# Altium schematic sheet MCU.SchDoc
size A; SheetNumber: 1; SheetTotal: 4
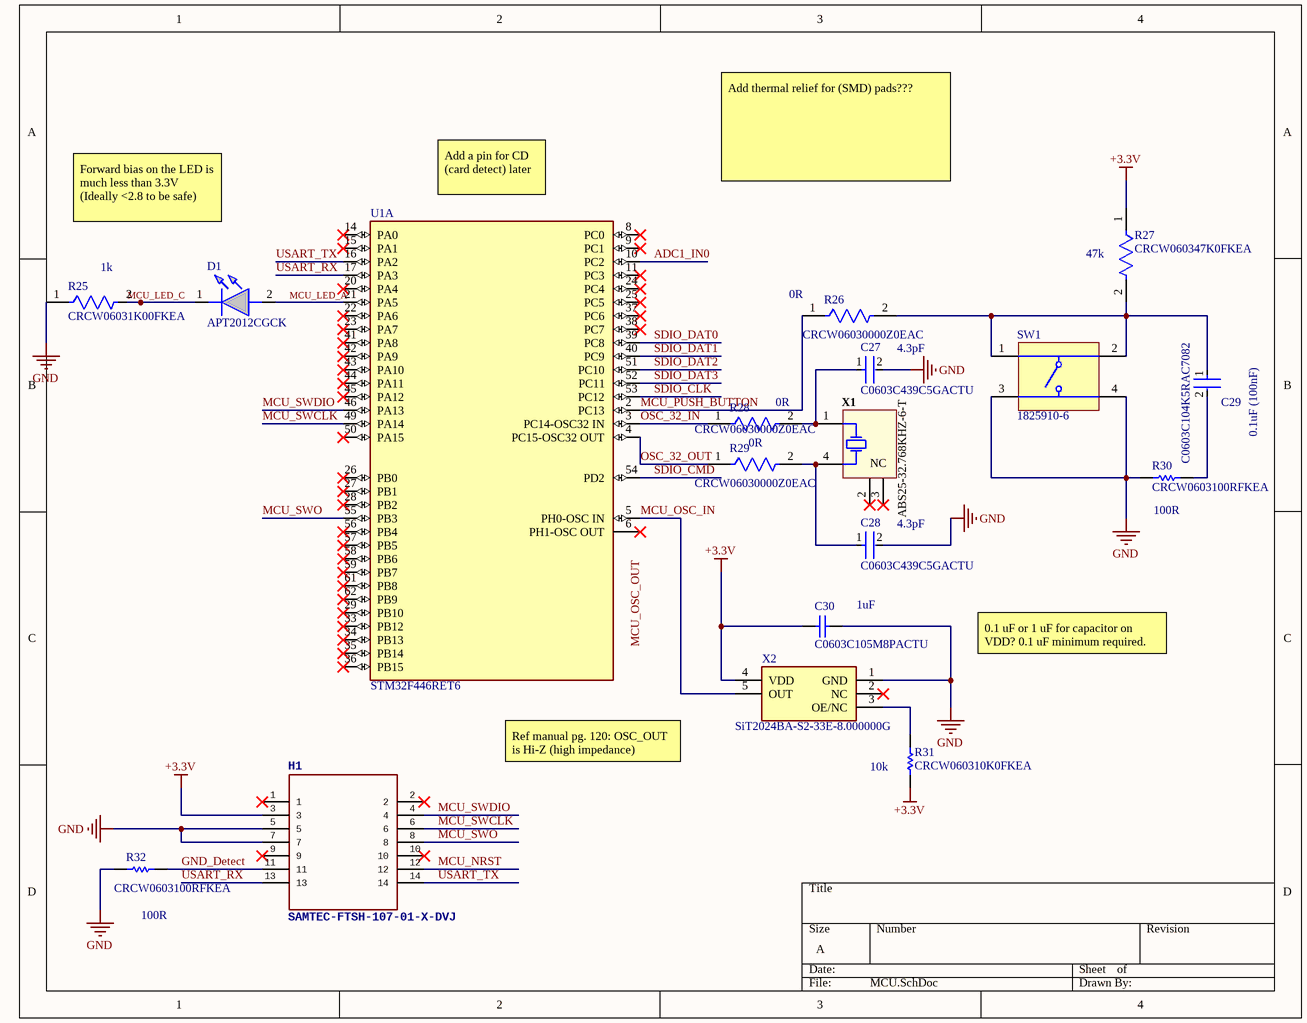
[diagram p0: MCU.SchDoc]

## Parts
C27  C0603C439C5GACTU  [FP-C0603C-CF-MFG]
C28  C0603C439C5GACTU  [FP-C0603C-CF-MFG]
C29  C0603C104K5RAC7082  [FP-C0603C-CF-MFG]
C30  C0603C105M8PACTU  [CAPC1608X90X35LL15T15]
D1  APT2012CGCK  [LEDC2012X50N]
H1  SAMTEC-FTSH-107-01-X-DVJ  [SAMTEC_FTSH-107-01-F-DV-K-P-TR]
R25  CRCW06031K00FKEA  [FP-CRCW0603-e3-MFG]
R26  CRCW06030000Z0EAC  [FP-CRCW0603-C-IPC_B]
R27  CRCW060347K0FKEA  [FP-CRCW0603-e3-IPC_B]
R28  CRCW06030000Z0EAC  [FP-CRCW0603-C-IPC_B]
R29  CRCW06030000Z0EAC  [FP-CRCW0603-C-IPC_B]
R30  CRCW0603100RFKEA  [RESC1609X50X30ML8T20]
R31  CRCW060310K0FKEA  [RESC1609X50X30NL8T20]
R32  CRCW0603100RFKEA  [RESC1609X50X30ML8T20]
SW1  1825910-6  [TECO-1825910-6_V]
U1  STM32F446RET6  [FP-LQFP64-5W-MFG]  (part A of 2)
X1  ABS25-32.768KHZ-6-T  [ABRA-ABS25-4_V]
X2  SiT2024BA-S2-33E-8.000000G  [SOT95P280X145-5N]

## Nets
+3.3V: C30.1 H1.3 R27.1 R31.2 X2.4(VDD)
GND: C27.2 C28.2 C30.2 H1.5 H1.7 R25.1 R30.2 R32.2 SW1.3 SW1.4 X2.1(GND)
ADC1_IN0: U1.10(PC2)
GND_Detect: H1.11 R32.1
MCU_LED_A: D1.2(A) U1.21(PA5)
MCU_LED_C: D1.1(K) R25.2
MCU_NRST: H1.12
MCU_OSC_IN: U1.5(PH0-OSC_IN) X2.5(OUT)
MCU_PUSH_BUTTON: R26.1 U1.2(PC13)
MCU_SWCLK: H1.6 U1.49(PA14)
MCU_SWDIO: H1.4 U1.46(PA13)
MCU_SWO: H1.8 U1.55(PB3)
OSC_32_IN: R28.1 U1.3(PC14-OSC32_IN)
OSC_32_OUT: R29.1 U1.4(PC15-OSC32_OUT)
SDIO_CLK: U1.53(PC12)
SDIO_CMD: U1.54(PD2)
SDIO_DAT0: U1.39(PC8)
SDIO_DAT1: U1.40(PC9)
SDIO_DAT2: U1.51(PC10)
SDIO_DAT3: U1.52(PC11)
USART_RX: H1.13 U1.17(PA3)
USART_TX: H1.14 U1.16(PA2)
NetC27_1: C27.1 R28.2 X1.1(X1)
NetC28_1: C28.1 R29.2 X1.4(X2)
NetC29_1: C29.1 R26.2 R27.2 SW1.1 SW1.2
NetC29_2: C29.2 R30.1
NetR31_1: R31.1 X2.3(OE/NC)

Not connected (* = marked no-connect by the designer): H1 1* 2* 9* 10*; U1 6(PH1-OSC_OUT)* 8(PC0)* 9(PC1)* 11(PC3)* 14(PA0)* 15(PA1)* 20(PA4)* 22(PA6)* 23(PA7)* 24(PC4)* 25(PC5)* 26(PB0)* 27(PB1)* 28(PB2)* 29(PB10)* 33(PB12)* 34(PB13)* 35(PB14)* 36(PB15)* 37(PC6)* 38(PC7)* 41(PA8)* 42(PA9)* 43(PA10)* 44(PA11)* 45(PA12)* 50(PA15)* 56(PB4)* 57(PB5)* 58(PB6)* 59(PB7)* 61(PB8)* 62(PB9)*; X1 2(NC)* 3(NC)*; X2 2(NC)*

## Notes on the sheet
- Forward bias on the LED is much less than 3.3V (Ideally <2.8 to be safe)
- (near U1) Add a pin for CD (card detect) later
- Add thermal relief for (SMD) pads???
- (near R25) 1k
- (near R26) 0R
- (near R27) 47k
- 4.3pF
- (near R28) 0R
- (near C29) 0.1uF (100nF)
- 0R
- (near C28) 4.3pF
- (near R30) 100R
- (near C30) 1uF
- 0.1 uF or 1 uF for capacitor on VDD? 0.1 uF minimum required.
- Ref manual pg. 120: OSC_OUT is Hi-Z (high impedance)
- (near R31) 10k
- (near R32) 100R
- Labels drawn without touching a wire or pin: MCU_OSC_OUT

## Library data of the parts
C27 C28 = CMP-1035-00305-3: CAP CER 4.3PF 50V NP0 0603; Manufacturer: KEMET; Automotive Grade: Grade 1; Tolerance: 0.25 pF; Material: Ceramic; Temperature Coefficient: 30ppm/°C; Temperature Characteristic: C0G; Voltage Rating: 50 V; Temperature Range High: +125°C; Temperature: -55°C to +125°C; Octopart: https://octopart.com/c0603c439c5gactu-kemet-8375741; Device Class L1: Passive Components; Package: C0603C-CF; RoHS: TRUE; ComponentLink2URL: https://api.kemet.com/component-edge/download/datasheet/C0603C100J5GACAUTO.pdf; ComponentLink2Description: Datasheet; Temperature Range Low: -55°C; Height: 0.87mm; Mouser Description: Capacitor, Ceramic, 4.3pF, 50VDC, .25-pF Tol, .25+pf Tol, C0G-TC Code, -30, 30ppm-TC; Lead Free: Yes; Capacitance: 4.3 pF; Category: Cap; Device Class L2: Capacitors; Manufacturer Part Number: C0603C439C5GACTU; Automotive: Yes; Digikey Description: CAP CER 4.3PF 50V NP0 0603; Device Class L3: Ceramic Capacitors; Value: 4.3 pF
C29 = CMP-03020-002411-2: C0603 0.10 μF X7R 30ppm/°C 10.00% 50 V; Manufacturer: KEMET; Voltage Rating: 50 V; Capacitance: 0.10 μF; Automotive Grade: Grade 1; Material: Ceramic; Value: 0.10 μF; Tolerance: 0.1; Automotive: Yes; Temperature Range Low: -55°C; Octopart: https://octopart.com/c0603c104k5rac7082-kemet-75146597; Temperature Coefficient: 30ppm/°C; ComponentLink2URL: https://api.kemet.com/component-edge/download/datasheet/C0603C100J5GACAUTO.pdf; RoHS: TRUE; ComponentLink2Description: Datasheet; Manufacturer Part Number: C0603C104K5RAC7082; Height: 0.87mm; Device Class L3: Ceramic Capacitors; Package: C0603C-CF; Temperature Characteristic: X7R; Device Class L2: Capacitors; Lead Free: Yes; Device Class L1: Passive Components; Temperature: -55°C to +125°C; Temperature Range High: +125°C; Category: Cap
C30 = CMP-2006-02271-1: Manufacturer: Kemet; Part Number: C0603C105M8PACTU
D1 = APT2012CGCK: Kingbright APT2012CGCK, APT2012 Series Green LED, 570 nm, 2012 (0805) Clear, Rectangle Lens SMD Package; Geometry.Height: 0.5mm; Mouser Part Number: 604-APT2012CGCK; Mouser Price/Stock: https://www.mouser.co.uk/ProductDetail/Kingbright/APT2012CGCK?qs=VdjlWU%2FzoOEv1TxC2gMNzg%3D%3D; Manufacturer_Name: Kingbright; Manufacturer_Part_Number: APT2012CGCK; Datasheet Link: https://componentsearchengine.com/Datasheets/1/APT2012CGCK.pdf
R25 = CMP-1666-00003-5: RES Thick Film, 1kΩ, 1%, 0.1W, 100ppm/°C, 0603; Max Power Dissipation: 100mW; Voltage Rating: 75V; Resistance: 1kR; Max Operating Temperature: 155°C; Number of Pins: 2; Case Code (Imperial): 0603; Width: 0.033inch; Power Rating: 100mW; Number of Terminations: 2; Package Quantity: 10; Weight: 7.1E-05oz; Tolerance: 1%; Temperature Coefficient: 100ppm/°C; Military Standard: Not; Mount: Surface Mount; Voltage Rating (DC): 75V; Depth: 0.85mm; Composition: Thick Film; Radiation Hardening: No; Termination: SMD/SMT; Length: 1.55mm; Case Code (Metric): 1608; Contact Plating: Tin; Min Operating Temperature: -55°C; Packaging: Tape and Reel; Height: 0.45mm; Lead Free: Lead Free; Case/Package: 0603; Features: Automotive AEC-Q200
R26 R28 R29 = CMP-02407-012292-2: RES 0 OHM JUMPER 1/10W 0603; Resistance: 22R; Power Rating: 100mW; Case/Package: Molded; Contact Plating: Tin; Resistor Type: Thick Film; Min Operating Temperature: -55°C; Termination: Wraparound; Max Operating Temperature: 155°C; Lead Free: Lead Free; Length: 1.55mm; RoHS Compliant: Yes; Mount: Surface Mount
R27 = CMP-2000-03379-3: RES SMD 47K OHM 1% 1/10W 0603; Voltage Rating: 75V; Max Power Dissipation: 100mW; Resistance: 47kR; Temperature Coefficient: 100ppm/°C; Size Code: 0603; Technology: THICK FILM; Case Code (Metric): 1608; Radiation Hardening: No; Case/Package: 0603; Number of Terminations: 2; Package Quantity: 5000; Width: 0.85mm; Series: CRCW; RoHS Compliant: Yes; Case Code (Imperial): 0603; Lead Free: Lead Free; Resistance Tolerance: 1%; Depth: 0.85mm; Contact Plating: Tin; Tolerance: 1%; Voltage Rating (DC): 75V; Min Operating Temperature: -55°C; Mount: Surface Mount; Packaging: Tape and Reel; Length: 1.55mm; Resistor Type: Thick Film; Features: Automotive AEC-Q200; Max Operating Temperature: 155°C; Weight: 7.1E-05oz; Construction: Rectangular; Height: 0.45mm; Military Standard: Not; Termination: SMD/SMT; Power Rating: 100mW
R30 R32 = CMP-2000-03824-5: Chip Resistor, 100 Ohm, +/- 1%, 100 mW,-55 to 155 degC, 0603 (1608 Metric), RoHS, Tape and Ree; Manufacturer: Vishay Semiconductor; ComponentLink2URL: http://www.vishay.com/docs/20035/dcrcwe3.pdf; ComponentLink1URL: http://www.vishay.com/; Mounting Technology: Surface Mount; ComponentLink1Description: Manufacturer URL; ComponentLink2Description: Datasheet; PackageDescription: 2-Pin Surface Mount Device, Body 1.575 x 0.85 mm; PackageReference: 0603; DatasheetVersion: 06/2012
R31 = CMP-1666-00005-4: Chip Resistor, 10 KOhm, +/- 1%, 100 mW, -55 to 155 degC, 0603 (1608 Metric), RoHS, Tape and Reel; Manufacturer: Vishay Semiconductor; Voltage Rating: 75 V; Max Operating Temperature: 155 degC; PackageDescription: 2-Pin Surface Mount Device, Body 1.575 x 0.85 mm; ComponentLink1Description: Manufacturer URL; RoHSCompliant: true; PackageReference: 0603; REACH SVHC: Unknown; Length: 1.55 mm; DatasheetVersion: 06/2012; Packaging: Tape and Reel; Min Operating Temperature: -55 degC; Mounting Technology: Surface Mount; ComponentLink2URL: https://datasheet.ciiva.com/11809/0900766b80d98afc-11809037.pdf; Height: 0.45 mm; ComponentLink2Description: Datasheet; Package Quantity: 5000; ComponentLink1URL: http://www.vishay.com/
SW1 = CMP-1684-00021-1: Tact Switch, SPST-NO, 0.05 A, -35 to 85 degC, 4-Pin THD, RoHS, Bulk; Manufacturer: TE Connectivity; Maximum Contact Resistance: 100mOhm; Mechanical Life: 100000Cycles; Bushing Type: Unthreaded; Switch Configuration: OFF(ON); Maximum DC Voltage Rating: 24V; Contact Rating @ Voltage: 0.05A@24VDC; Actuator Color: Black; Body Orientation: Straight; Function: MomentaryContact; Illumination: N/R; Actuator Style: RoundButton; Actuator Material: PolybutyleneTerephthalate; Dielectric Strength: 500VAC; Pole Throw Configuration: SPST; Actuator Length: 1.4mm; Product Weight: N/A; Contact Material: CopperAlloy; Housing Material: N/A; Terminal Type: PCPins; Minimum Insulation Resistance: 100MOhm; Package Description: 4-Pin Through Hole Device, Body 5.99 x 5.99 mm, Pitch 6.5 mm; Part No: 1825910-6; Package Reference: THD; Base Material: N/A; Manufacturer URL: http://www.te.com; Contact Plating: Silver; RoHS: Yes; Datasheet Version: Rev. C9; Electrical Life: 100000Cycles; Maximum AC Voltage Rating: N/A; Thread Size: N/R; Operating Temperature: -35to85C; Mounting: ThroughHole; Dimension: 5.99x5mm; Datasheet URL: http://www.te.com/commerce/DocumentDelivery/DDEController?Action=showdoc&DocId=Customer+Drawing%7F1825910%7FC9%7Fpdf%7FEnglish%7FENG_CD_1825910_C9.pdf%7F1825910-6; Family: 1825910; Seal Location: N/A; Seal Description: N/A; Packaging: N/A
U1 = CMP-12105-000007-1: IC MCU 32BIT 512KB FLASH 64LQFP; Manufacturer: ST; Number Of Spi Channels: 4; Ram Size: 128KBytes; Standoff Height: 0.05mm; Number Of Uart Channels: 6; Number Of Pwm Channels: 32; Max Junction Temp: +105°C; Number Of I/Os: 50; Number Of Usb Channels: 2; Frequency: 180MHz; Number Of A/D Converters: 3; Max Supply Voltage: 3.6V; Number Of Adc Channels: 16; Interface: I2C,SPI,UART,USART,CAN,USB,LIN,IrDA,I2S,Other; Memory Size: 512KBytes; Number Of Timers/Counters: 14; Min Supply Voltage: 1.7V; Core Architecture: ARM Cortex-M4; Data Bus Width: 32bits; Number Of Cores: 1; Ambient Temperature Range Low: -40°C; ComponentLink2URL: https://www.st.com/en/microcontrollers-microprocessors/stm32f446re.html; Category: IC; Height: 1.6mm; Ipc Land Pattern Name: QFP50P1200X1200X160-64; Manufacturer Part Number: STM32F446RET6; Octopart: https://octopart.com/stm32f446ret6-stmicroelectronics-52642920; Temperature Range High: +105°C; Lead Free: Yes; Mouser Description: ARM Microcontrollers - MCU High-performance and DSP with FP, ARM Cortex-M4 MCU with 512 Kbytes Flash, 180 MHz CPU, Art Accelerator, SDRAM; Digikey Description: IC MCU 32BIT 512KB FLASH 64LQFP; Ambient Temperature Range High: +85°C; Number Of I2C Channels: 4; Memory Type: FLASH; RoHS: TRUE; Automotive: No; Device Class L1: Integrated Circuits (ICs); Temperature: -40°C to +105°C; Device Class L2: Embedded Processors and Controllers; Device Class L3: Microcontrollers; Temperature Range Low: -40°C; Package: LQFP64-5W; ComponentLink2Description: Datasheet
X1 = CMP-2000-05036-1: Low Frequency Crystal, 32.768 KHz, 6 pF, +/- 20 ppm, -40 to 85 degC, 4-Pin SMD, RoHS, Tape and Reel; Manufacturer: Abracon; Tolerance: 20PPM; ESR: 50kOhms; Case Width: 3.8mm; Case Height: 2.5mm; Case Length: 8mm; Load Capacitance: 6pF; Operating Temperature Range: -40Cto+85C; Package Reference: ABS25; Factory Pack Quantity: 3000; Package Description: 4-Pin Surface Mount Device, Body 8 x 3.8 mm, Pitch 5.5 mm; Frequency: 32.768kHz; Termination Style: SMD/SMT; Manufacturer URL: http://www.abracon.com/; Type: LowFrequencyCrystal; Dimensions: 3.8mmWx8mmLx2.5mmH; Product Category: Crystals; Series: ABS25; RoHS: Details; Package / Case: 8mmx3.8mm; Datasheet Version: Jun-17; Brand: ABRACON; Datasheet URL: https://datasheet.ciiva.com/854/abs25-854528.pdf; Packaging: Reel; Mounting Style: SMD/SMT
X2 = SiT2024BA-S2-33E-8.000000G: Standard Clock Oscillators 8MHz 3.3V -40C +125C AEC-Q100; Manufacturer_Name: SiTime; Geometry.Height: 1.45mm; Mouser Part Number: 788-2024BA-S2-33E-8G; Mouser Price/Stock: https://www.mouser.com/Search/Refine.aspx?Keyword=788-2024BA-S2-33E-8G; Manufacturer_Part_Number: SiT2024BA-S2-33E-8.000000G; Datasheet Link: https://componentsearchengine.com/Datasheets/1/SiT2024BA-S2-33E-8.000000G.pdf